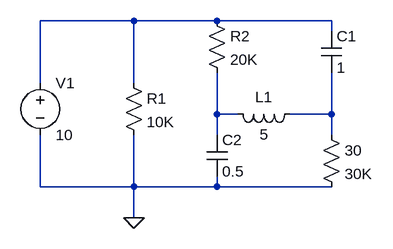
[diagram p0: schematic figure26.asc]
figure26.asc, the LTspice schematic file:
Version 4
SHEET 1 880 680
WIRE 128 64 -16 64
WIRE 256 64 128 64
WIRE 432 64 256 64
WIRE 432 80 432 64
WIRE -16 160 -16 64
WIRE 128 160 128 64
WIRE 256 208 256 144
WIRE 288 208 256 208
WIRE 432 208 432 144
WIRE 432 208 368 208
WIRE 256 240 256 208
WIRE 432 240 432 208
WIRE -16 320 -16 240
WIRE 128 320 128 240
WIRE 128 320 -16 320
WIRE 256 320 256 304
WIRE 256 320 128 320
WIRE 432 320 256 320
WIRE 128 368 128 320
FLAG 128 368 0
SYMBOL voltage -16 144 R0
WINDOW 123 0 0 Left 0
WINDOW 39 0 0 Left 0
SYMATTR InstName V1
SYMATTR Value 10
SYMBOL res 112 144 R0
SYMATTR InstName R1
SYMATTR Value 10K
SYMBOL res 240 48 R0
SYMATTR InstName R2
SYMATTR Value 20K
SYMBOL res 416 224 R0
SYMATTR InstName 30
SYMATTR Value 30K
SYMBOL ind 384 192 R90
WINDOW 0 5 56 VBottom 2
WINDOW 3 32 56 VTop 2
SYMATTR InstName L1
SYMATTR Value 5
SYMBOL cap 416 80 R0
SYMATTR InstName C1
SYMATTR Value 1
SYMBOL cap 240 240 R0
SYMATTR InstName C2
SYMATTR Value 0.5

The netlist it stands for:
* figure26.asc
V1 N001 0 10
R1 N001 0 10K
R2 N001 N002 20K
R§30 N003 0 30K
L1 N003 N002 5
C1 N001 N003 1
C2 N002 0 0.5
.backanno
.end